# Altium schematic sheet Mobile Signal Jammer.schdoc
size 202 x 106 mm
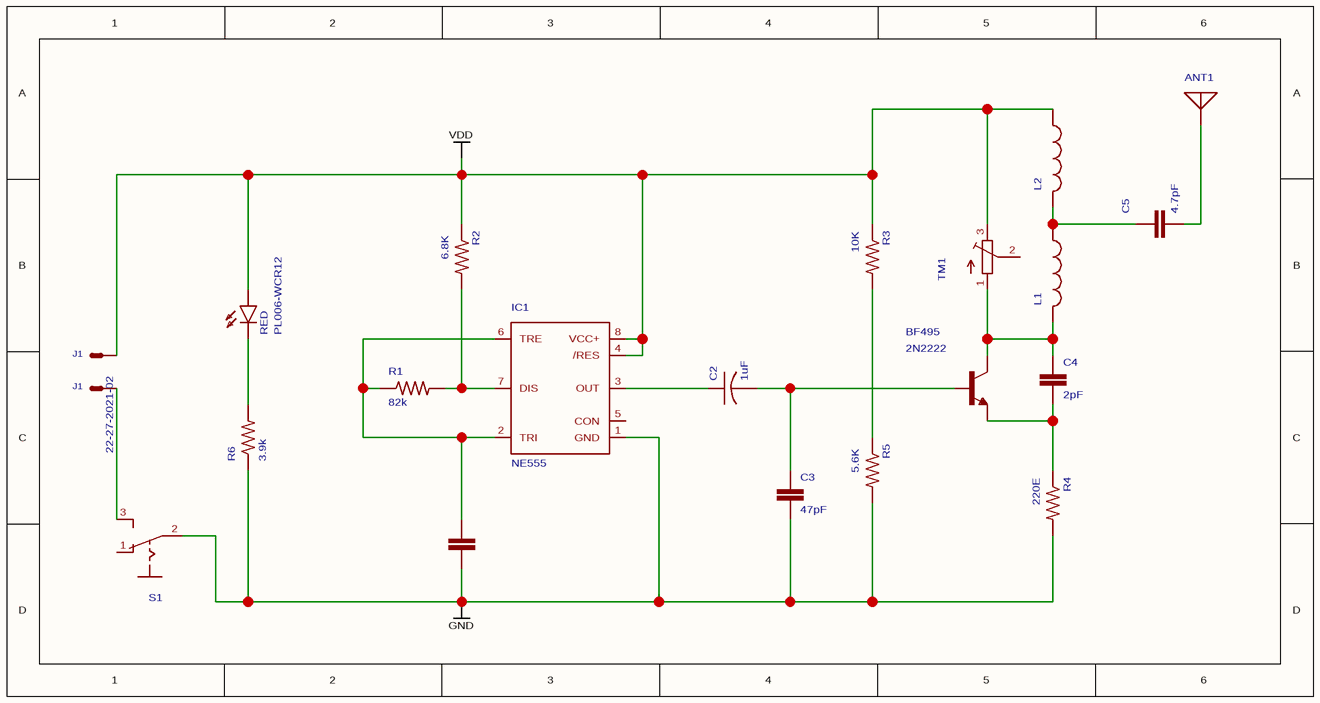
[diagram p0: Mobile Signal Jammer.schdoc]

## Parts
(Parts that share a designator on the sheet are numbered #1, #2 ... from top to bottom, then left to right.)
ANT1  ANTENNA  [PAD-01]  (value not drawn)
BF495  2N2222  [TO92-EBC-OVAL]
C1  C  (value not drawn)
C2  1uF  [C025-025X050]
C3  47pF  [C5B3.5]
C4  2pF  [C5B3.5]
C5  4.7pF  [C5B3.5]
IC1  NE555  [DIL-08]
J1#1  22-27-2021-02  [6410-02]
J1#2  22-27-2021-02  [6410-02]  (value not drawn)
L1  L-USTJ4-U1  [TJ4-U1]  (value not drawn)
L2  L-USTJ4-U1  [TJ4-U1]  (value not drawn)
R1  82k  [0805-THM]
R2  6.8K  [0805-THM]
R3  10K  [0805-THM]
R4  220E  [0805-THM]
R5  5.6K  [0805-THM]
R6  3.9k  [0805-THM]
RED  PL006-WCR12  [SOT23]
S1  M251  [M251]  (value not drawn)
TM1  TRIMPOTTC33X  [TC33X]  (value not drawn)

## Nets
GND: C3.2 IC1.1(GND) R4.2 R5.2 R6.1 S1.2(P)
VDD: IC1.4(/RES) IC1.8(VCC+) J1#1.1(S) L2.1 R2.1 R3.1 RED.1(A) TM1.3(E)
NetANT1_1: ANT1.1 C5.2
NetBF495_B: BF495.B C2.2 C3.1
NetBF495_C: BF495.C C4.1 L1.2 TM1.1(A)
NetBF495_E: BF495.E C4.2 R4.1
NetC2_1: C2.1 IC1.3(OUT)
NetC5_1: C5.1 L1.1 L2.2
NetIC1_2: IC1.2(TRI) IC1.6(TRE) R1.1
NetIC1_7: IC1.7(DIS) R1.2 R2.2
NetJ1#2_2: J1#2.2(S) S1.3(S)
NetR3_2: R3.2 R5.1
NetR6_2: R6.2 RED.3(C)

Not connected (* = marked no-connect by the designer): IC1 5(CON); S1 1(O); TM1 2(S)